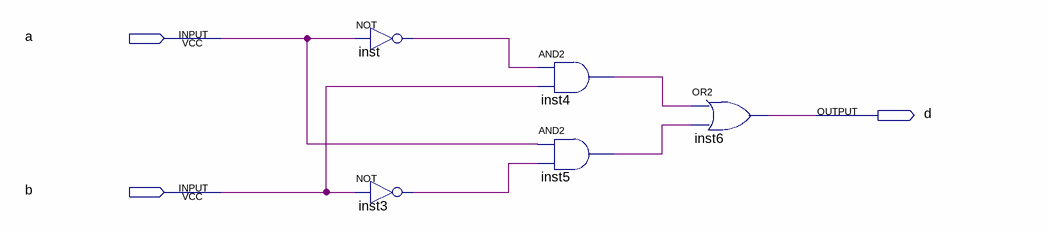
[diagram p0: schematic sheet]
// Quartus schematic myxor2.bdf as structural Verilog: 5 symbols, 3 pins
module myxor2 (
  input  a,
  input  b,
  output d
);

  wire inst3_out, inst4_out, inst5_out, inst_out;

  not inst (inst_out, a);
  not inst3 (inst3_out, b);
  and inst4 (inst4_out, inst_out, b);
  and inst5 (inst5_out, a, inst3_out);
  or inst6 (d, inst4_out, inst5_out);
endmodule
